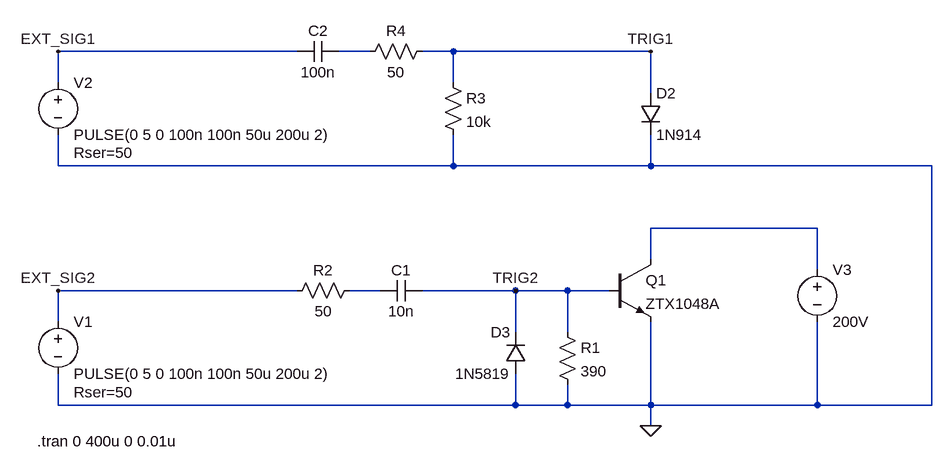
[diagram p0: schematic tigger_filter.asc]
tigger_filter.asc, the LTspice schematic file:
Version 4.1
SHEET 1 880 680
WIRE -128 -304 -496 -304
WIRE -16 -304 -64 -304
WIRE 112 -304 64 -304
WIRE 416 -304 112 -304
WIRE -496 -256 -496 -304
WIRE 112 -256 112 -304
WIRE 416 -240 416 -304
WIRE -496 -128 -496 -176
WIRE 112 -128 112 -176
WIRE 112 -128 -496 -128
WIRE 416 -128 416 -176
WIRE 416 -128 112 -128
WIRE 848 -128 416 -128
WIRE 672 -32 416 -32
WIRE 416 16 416 -32
WIRE 672 32 672 -32
WIRE -128 64 -496 64
WIRE 0 64 -48 64
WIRE 208 64 64 64
WIRE 288 64 208 64
WIRE 352 64 288 64
WIRE -496 112 -496 64
WIRE 208 128 208 64
WIRE 288 128 288 64
WIRE -496 240 -496 192
WIRE 208 240 208 192
WIRE 208 240 -496 240
WIRE 288 240 288 208
WIRE 288 240 208 240
WIRE 416 240 416 112
WIRE 416 240 288 240
WIRE 672 240 672 112
WIRE 672 240 416 240
WIRE 848 240 848 -128
WIRE 848 240 672 240
WIRE 416 272 416 240
FLAG 416 272 0
FLAG 208 64 TRIG2
FLAG -496 64 EXT_SIG2
FLAG 416 -304 TRIG1
FLAG -496 -304 EXT_SIG1
SYMBOL res 272 112 R0
SYMATTR InstName R1
SYMATTR Value 390
SYMBOL res -32 48 R90
WINDOW 0 0 56 VBottom 2
WINDOW 3 32 56 VTop 2
SYMATTR InstName R2
SYMATTR Value 50
SYMBOL cap 0 80 R270
WINDOW 0 32 32 VTop 2
WINDOW 3 0 32 VBottom 2
SYMATTR InstName C1
SYMATTR Value 10n
SYMBOL voltage -496 96 R0
WINDOW 123 0 0 Left 0
WINDOW 39 24 124 Left 2
SYMATTR InstName V1
SYMATTR Value PULSE(0 5 0 100n 100n 50u 200u 2)
SYMATTR SpiceLine Rser=50
SYMBOL res 96 -272 R0
SYMATTR InstName R3
SYMATTR Value 10k
SYMBOL res 80 -320 R90
WINDOW 0 0 56 VBottom 2
WINDOW 3 32 56 VTop 2
SYMATTR InstName R4
SYMATTR Value 50
SYMBOL cap -64 -320 R90
WINDOW 0 0 32 VBottom 2
WINDOW 3 32 32 VTop 2
SYMATTR InstName C2
SYMATTR Value 100n
SYMBOL diode 400 -240 R0
SYMATTR InstName D2
SYMATTR Value 1N914
SYMBOL diode 224 192 R180
WINDOW 0 24 64 Left 2
WINDOW 3 24 0 Left 2
SYMATTR InstName D3
SYMATTR Value 1N5819
SYMATTR Description Diode
SYMATTR Type diode
SYMBOL npn 352 16 R0
SYMATTR InstName Q1
SYMATTR Value ZTX1048A
SYMBOL voltage 672 16 R0
WINDOW 123 0 0 Left 0
WINDOW 39 0 0 Left 0
SYMATTR InstName V3
SYMATTR Value 200V
SYMBOL voltage -496 -272 R0
WINDOW 123 0 0 Left 0
WINDOW 39 24 124 Left 2
SYMATTR InstName V2
SYMATTR Value PULSE(0 5 0 100n 100n 50u 200u 2)
SYMATTR SpiceLine Rser=50
TEXT -528 296 Left 2 !.tran 0 400u 0 0.01u

The netlist it stands for:
* tigger_filter.asc
R1 TRIG2 0 390
R2 N003 EXT_SIG2 50
C1 N003 TRIG2 10n
V1 EXT_SIG2 0 PULSE(0 5 0 100n 100n 50u 200u 2) Rser=50
R3 TRIG1 0 10k
R4 TRIG1 N001 50
C2 N001 EXT_SIG1 100n
D2 TRIG1 0 1N914
D3 0 TRIG2 1N5819
Q1 N002 TRIG2 0 0 ZTX1048A
V3 N002 0 200V
V2 EXT_SIG1 0 PULSE(0 5 0 100n 100n 50u 200u 2) Rser=50
.model D D
.lib standard.dio
.model NPN NPN
.model PNP PNP
.lib standard.bjt
.tran 0 400u 0 0.01u
.backanno
.end